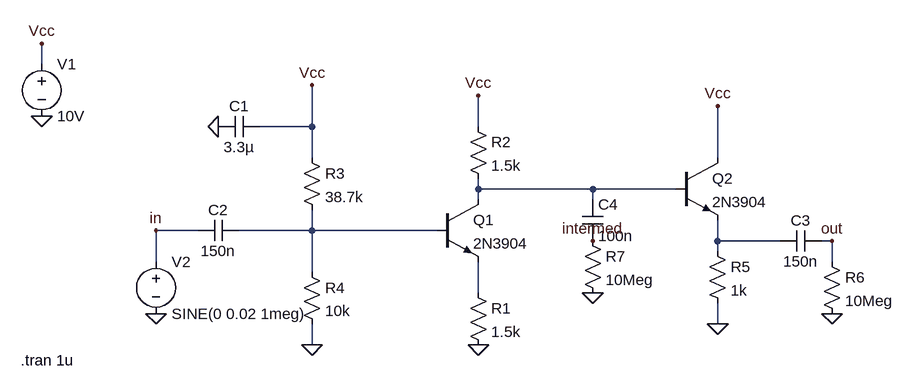
[diagram p0: schematic Lab2_2N3904_CB_inputstage_analysis.asc]
Lab2_2N3904_CB_inputstage_analysis.asc, the LTspice schematic file:
Version 4.1
SHEET 1 880 680
WIRE -560 -64 -560 -96
WIRE -144 32 -144 -32
WIRE -144 32 -224 32
WIRE 112 32 112 -16
WIRE -144 80 -144 32
WIRE 480 80 480 0
WIRE 112 128 112 112
WIRE 288 128 112 128
WIRE 416 128 288 128
WIRE 112 144 112 128
WIRE 288 144 288 128
WIRE -320 192 -384 192
WIRE -144 192 -144 160
WIRE -144 192 -256 192
WIRE 48 192 -144 192
WIRE 480 208 480 176
WIRE 576 208 480 208
WIRE 656 208 640 208
WIRE 480 224 480 208
WIRE -384 240 -384 192
WIRE 656 240 656 208
WIRE -144 256 -144 192
WIRE 112 288 112 240
WIRE 480 336 480 304
WIRE -144 368 -144 336
FLAG 112 368 0
FLAG -144 368 0
FLAG -288 32 0
FLAG -560 16 0
FLAG -560 -96 Vcc
FLAG -144 -32 Vcc
FLAG 112 -16 Vcc
FLAG 480 336 0
FLAG 480 0 Vcc
FLAG -384 192 in
FLAG 656 208 out
FLAG -384 320 0
FLAG 656 320 0
FLAG 288 208 intermed
FLAG 288 288 0
DATAFLAG -32 192 ""
DATAFLAG 112 272 ""
DATAFLAG 112 16 ""
DATAFLAG 288 128 ""
DATAFLAG 512 208 ""
SYMBOL npn 48 144 R0
SYMATTR InstName Q1
SYMATTR Value 2N3904
SYMBOL res 96 272 R0
SYMATTR InstName R1
SYMATTR Value 1.5k
SYMBOL res 96 16 R0
SYMATTR InstName R2
SYMATTR Value 1.5k
SYMBOL res -160 64 R0
SYMATTR InstName R3
SYMATTR Value 38.7k
SYMBOL res -160 240 R0
SYMATTR InstName R4
SYMATTR Value 10k
SYMBOL cap -224 16 R90
WINDOW 0 0 32 VBottom 2
WINDOW 3 32 32 VTop 2
SYMATTR InstName C1
SYMATTR Value 3.3µ
SYMBOL voltage -560 -80 R0
WINDOW 123 0 0 Left 0
WINDOW 39 0 0 Left 0
SYMATTR InstName V1
SYMATTR Value 10V
SYMBOL npn 416 80 R0
SYMATTR InstName Q2
SYMATTR Value 2N3904
SYMBOL res 464 208 R0
SYMATTR InstName R5
SYMATTR Value 1k
SYMBOL cap -256 176 R90
WINDOW 0 0 32 VBottom 2
WINDOW 3 32 32 VTop 2
SYMATTR InstName C2
SYMATTR Value 150n
SYMBOL voltage -384 224 R0
WINDOW 123 0 0 Left 0
WINDOW 39 0 0 Left 0
SYMATTR InstName V2
SYMATTR Value SINE(0 0.02 1meg)
SYMBOL cap 640 192 R90
WINDOW 0 0 32 VBottom 2
WINDOW 3 32 32 VTop 2
SYMATTR InstName C3
SYMATTR Value 150n
SYMBOL res 640 224 R0
SYMATTR InstName R6
SYMATTR Value 10Meg
SYMBOL cap 272 144 R0
SYMATTR InstName C4
SYMATTR Value 100n
SYMBOL res 272 192 R0
SYMATTR InstName R7
SYMATTR Value 10Meg
TEXT -592 392 Left 2 !.tran 1u

The netlist it stands for:
* Lab2_2N3904_CB_inputstage_analysis.asc
Q1 N001 N002 N004 0 2N3904
R1 N004 0 1.5k
R2 Vcc N001 1.5k
R3 Vcc N002 38.7k
R4 N002 0 10k
C1 Vcc 0 3.3µ
V1 Vcc 0 10V
Q2 Vcc N001 N003 0 2N3904
R5 N003 0 1k
C2 N002 in 150n
V2 in 0 SINE(0 0.02 1meg)
C3 out N003 150n
R6 out 0 10Meg
C4 N001 intermed 100n
R7 intermed 0 10Meg
.model NPN NPN
.model PNP PNP
.lib standard.bjt
.tran 1u
.backanno
.end